# EAGLE design control AC (EAGLE 8.2.1)
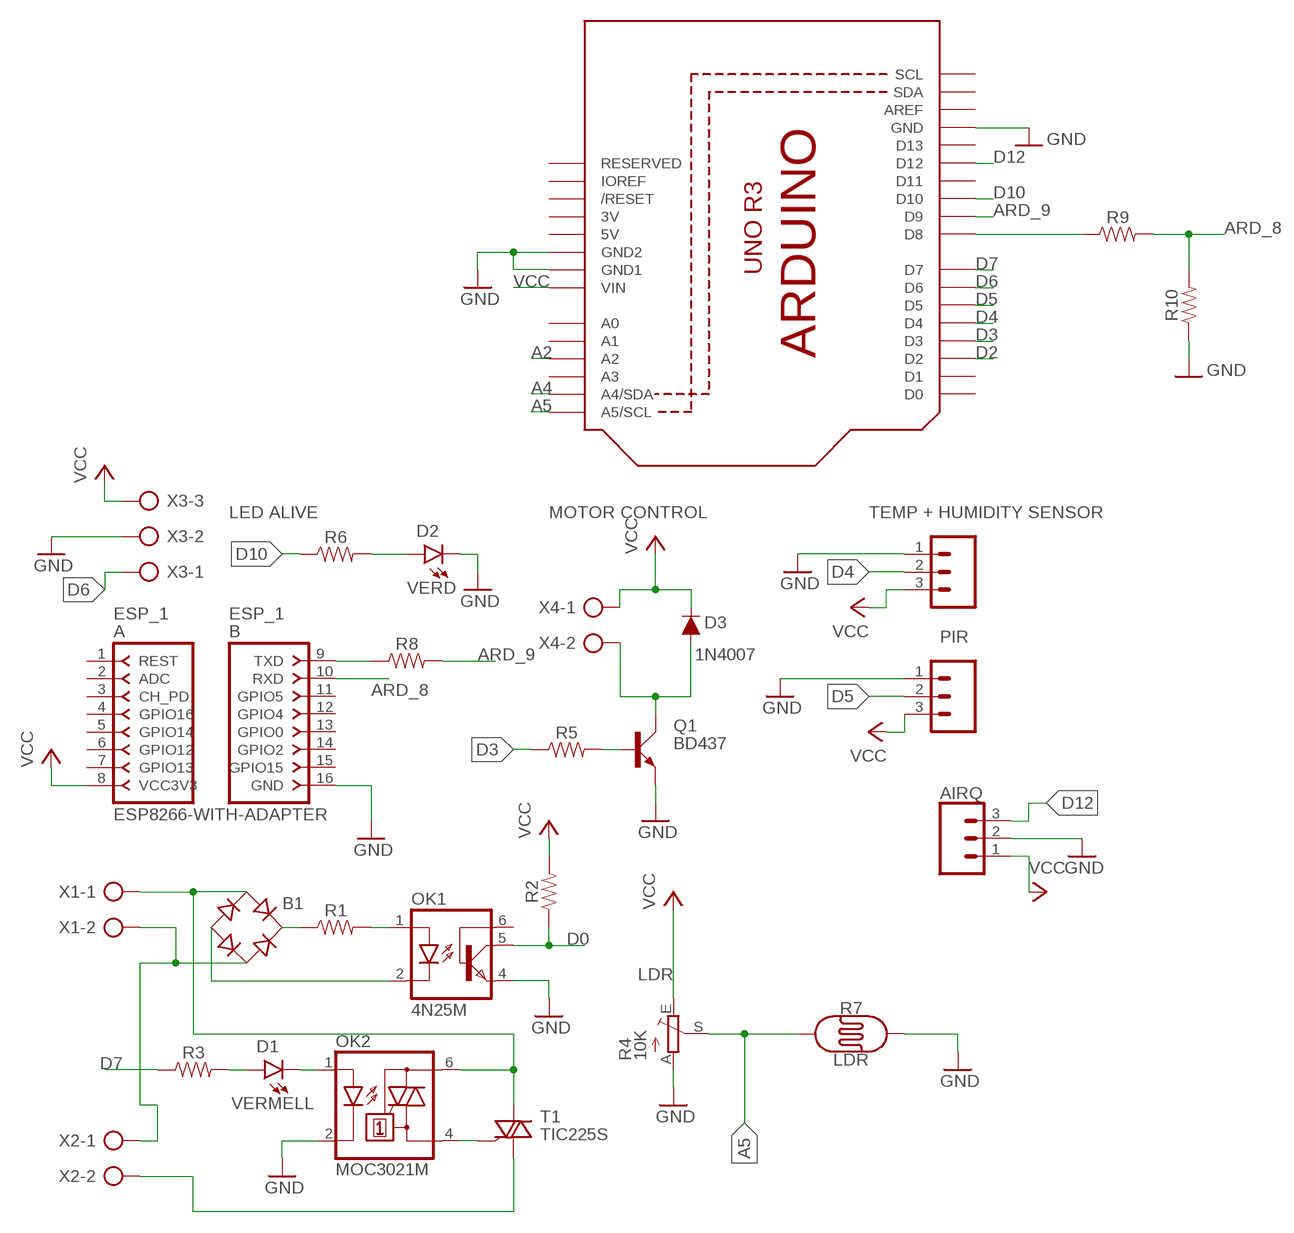
[diagram p0: schematic, sheet 1]

## Parts
AIRQ  CONN_03  [1X03]
B1  RB1A  [RB1A]
D1  VERMELL  LED-RED1206  [LED-1206]
D2  VERD  LED-FKIT-1206  [FKIT-LED-1206]
D3  1N4007  DIODE-PTH  [DIODE-1N4001]
ESP_1  ESP8266-WITH-ADAPTER  [ESP8266-ADAPTER]
OK1  4N25M  [DIL06]
OK2  MOC3021M  [DIL06]
PIR  455-1750-1-ND  CONN_03  [1X03]
Q1  BD437  [TO126AV]
R1  RESISTOR0805  [0805]
R2  RESISTOR0805  [0805]
R3  RESISTOR0805  [0805]
R4  10K  TRIM_EU-LI10  [LI10]
R5  RESISTOR0805  [0805]
R6  RESISTOR0805  [0805]
R7  LDR  PHOTOCELLPTH-KIT  [PHOTOCELL-KIT]
R8  RESISTOR0805  [0805]
R9  RESISTOR0805  [0805]
R10  RESISTOR0805  [0805]
T1  TIC225S  [TO220DS]
TEMP+HUM  455-1750-1-ND  CONN_03  [1X03]
U2  ARDUINOR3-DIMENSION  [ARDUINOR3]
X1  AK500/2  [AK500/2]
X2  AK500/2  [AK500/2]
X3  AK500/3  [AK500/3]
X4  AK500/2  [AK500/2]

## Nets
A2: U2.A2
A4: U2.A4(A4/SDA)
A5: R4.S R7.1 U2.A5(A5/SCL)
ARD_8: ESP_1.10(RXD) R9.2 R10.2
ARD_9: R8.2 U2.D9
D0: OK1.5(COL) R2.1
D2: U2.D2
D3: R5.1 U2.D3
D4: TEMP+HUM.2 U2.D4
D5: PIR.2 U2.D5
D6: U2.D6 X3.1
D7: R3.1 U2.D7
D10: R6.1 U2.D10
D12: AIRQ.3 U2.D12
GND: AIRQ.2 D2.C ESP_1.16(GND) OK1.4(EMI) OK2.2(C) PIR.1 Q1.E R4.A R7.2 R10.1 TEMP+HUM.1 U2.GND U2.GND1 U2.GND2 X3.2
N$1: OK1.1(A) R1.2
N$2: B1.+ R1.1
N$3: B1.- OK1.2(C)
N$4: B1.AC1 OK2.6(A2) T1.A2 X1.1
N$5: B1.AC2 X1.2 X2.1
N$6: Q1.B R5.2
N$7: D1.A R3.2
N$8: D1.C OK2.1(A)
N$9: D2.A R6.2
N$10: OK2.4(A1) T1.G
N$11: T1.A1 X2.2
N$12: D3.A Q1.C X4.2
N$13: ESP_1.9(TXD) R8.1
N$14: R9.1 U2.D8
VCC: AIRQ.1 D3.C ESP_1.8(VCC3V3) PIR.3 R2.2 R4.E TEMP+HUM.3 U2.VIN X3.3 X4.1
Unconnected: ESP_1.1(REST) ESP_1.2(ADC) ESP_1.3(CH_PD) ESP_1.4(GPIO16) ESP_1.5(GPIO14) ESP_1.6(GPIO12) ESP_1.7(GPIO13) ESP_1.11(GPIO5) ESP_1.12(GPIO4) ESP_1.13(GPIO0) ESP_1.14(GPIO2) ESP_1.15(GPIO15) OK1.6(BAS) U2.A0 U2.A1 U2.A3 U2.AREF U2.D0 U2.D1 U2.D11 U2.D13 U2.IOREF U2.RESERVED U2.RESET(/RESET) U2.SCL U2.SDA

## Notes on the sheet
- LED ALIVE | MOTOR CONTROL | TEMP + HUMIDITY SENSOR
- PIR
- LDR

## Power pins joined to a net without a drawn wire
3V: U2.3V
5V: U2.5V

## Library data of the parts
AIRQ = SparkFun-Connectors:CONN_03: Multi connection point. Often used as Generic Header-pin footprint for 0.1 inch spaced/style header connections On any of the 0.1 inch spaced packages, you can populate with these: Break Away Headers - Straight <https://www.sparkfun.com/products/116> (PRT-00116) Break Away Male Headers - Right Angle <https://www.sparkfun.com/products/553> (PRT-00553) Female Headers <https://www.sparkfun.com/products/115> (PRT-00115) Break Away Headers - Machine Pin <https://www.sparkfun.com/products/117> (PRT-00117) Break Away Female Headers - Swiss Machine Pin <https://www.sparkfun.com/products/743> (PRT-00743) Stackable Header - 3 Pin (Female, 0.1") <https://www.sparkfun.com/products/13875> (PRT-13875) For SCREWTERMINALS and SPRING TERMINALS visit here: Screw Terimnals on SparkFun.com <https://www.sparkfun.com/search/results?term=Screw+Terminals> (5mm/3.5mm/2.54mm spacing) This device is also useful as a general connection point to wire up your design to another part of your project. Our various solder wires solder well into these plated through hole pads. Hook-Up Wire - Assortment (Stranded, 22 AWG) <https://www.sparkfun.com/products/11375> (PRT-11375) Hook-Up Wire - Assortment (Solid Core, 22 AWG) <https://www.sparkfun.com/products/11367> (PRT-11367) View the entire wire category on our website here <https://www.sparkfun.com/categories/141> Special notes: Molex polarized connector foot print use with SKU : PRT-08232 with associated crimp pins and housings.
B1 = rectifier:RB1A: RECTIFIER 1 A
D1 = SparkFun-LED:LED-RED: Red SMD LED Used in manufacturing of most products at SparkFun Packages: 0603 - SMD 0603 package [Product Link] <http://docs.avagotech.com/docs/AV02-0551EN> 0603 SMART - SMD 0603 SMART package ( more efficient and expensive)[Product Link] <http://www.osram-os.com/Graphics/XPic2/00077099_0.pdf> 1206 - SMD1206 package [Product Link] <https://www.sparkfun.com/datasheets/DevTools/LilyPad/Q150OVS4.pdff> SparkFun Products: Pro Mini 328 -5V <https://www.sparkfun.com/products/821> RedBoard <https://www.sparkfun.com/products/12757> IOIO-OTG <https://www.sparkfun.com/products/13613>; PROD_ID: DIO-09912; VALUE: RED
D2 = SparkFun-LED:LED: LED (Generic) Standard schematic elements and footprints for 5mm, 3mm, 1206, and 0603 sized LEDs. Generic LEDs with no color specified.
D3 = SparkFun-DiscreteSemi:DIODE: Diode These are standard reverse protection diodes and small signal diodes. SparkFun Products: SparkFun SparkPunk Sound Kit <https://www.sparkfun.com/products/11177> SparkFun ESP8266 Thing <https://www.sparkfun.com/products/13231>; PROD_ID: DIO-09176; VALUE: 1A/50V/1.1V
ESP_1 = esp8266_with_adapter:ESP8266-WITH-ADAPTER: ESP8266 Adapter for ESP8266-03, ESP8266-04, ESP8266-07, ESP8266-08, ESP8266-12 and similar. (c) by Bartosz Batorek obi--wan@wp.pl
OK1 = optocoupler:4N*?M: General Purpose 6-Pin Phototransistor Optocouplers Source: http://www.fairchildsemi.com/ds/4N/4N35-M.pdf; MPN: 4N25-M; OC_FARNELL: 1021349; OC_NEWARK: 98K9084
OK2 = optocoupler:MOC30*M: RANDOM-PHASE OPTOISOLATORS TRIAC DRIVER OUTPUT Source: http://www.fairchildsemi.com MOC3020-M.pdf; MF: FAIRCHILD SEMICONDUCTOR; MPN: MOC3021-M; OC_FARNELL: 1021365; OC_NEWARK: 95B7895
PIR TEMP+HUM = SparkFun-Connectors:CONN_03: Multi connection point. Often used as Generic Header-pin footprint for 0.1 inch spaced/style header connections On any of the 0.1 inch spaced packages, you can populate with these: Break Away Headers - Straight <https://www.sparkfun.com/products/116> (PRT-00116) Break Away Male Headers - Right Angle <https://www.sparkfun.com/products/553> (PRT-00553) Female Headers <https://www.sparkfun.com/products/115> (PRT-00115) Break Away Headers - Machine Pin <https://www.sparkfun.com/products/117> (PRT-00117) Break Away Female Headers - Swiss Machine Pin <https://www.sparkfun.com/products/743> (PRT-00743) Stackable Header - 3 Pin (Female, 0.1") <https://www.sparkfun.com/products/13875> (PRT-13875) For SCREWTERMINALS and SPRING TERMINALS visit here: Screw Terimnals on SparkFun.com <https://www.sparkfun.com/search/results?term=Screw+Terminals> (5mm/3.5mm/2.54mm spacing) This device is also useful as a general connection point to wire up your design to another part of your project. Our various solder wires solder well into these plated through hole pads. Hook-Up Wire - Assortment (Stranded, 22 AWG) <https://www.sparkfun.com/products/11375> (PRT-11375) Hook-Up Wire - Assortment (Solid Core, 22 AWG) <https://www.sparkfun.com/products/11367> (PRT-11367) View the entire wire category on our website here <https://www.sparkfun.com/categories/141> Special notes: Molex polarized connector foot print use with SKU : PRT-08232 with associated crimp pins and housings.; PROD_ID: XXX-00000
Q1 = transistor-power:BD437: NPN TRANSISTOR
R1-R3 R5 R6 R8-R10 = SparkFun-Resistors:RESISTOR: Generic Resistor Package
R4 = pot:TRIM_EU-: POTENTIOMETER
R7 = SparkFun-Sensors:PHOTOCELL: Photocell (Photodetector, Photo Resistor, CdS) This is a very small light sensor. A photocell changes (also called a photodetector, photo resistor, CdS or photoconductive cell) resistance depending on the amount of light it is exposed to. These little sensors make great ambient light triggers (when light in the room turns on, do something). Datasheet <http://cdn.sparkfun.com/datasheets/Sensors/LightImaging/SEN-09088.pdf> SparkFun Products Mini Photocell <https://www.sparkfun.com/products/9088> (SEN-09088); PROD_ID: COMP-09129; SF_ID: SEN-09088
T1 = triac:TIC225S: TRIAC
U2 = adafruit_meva:ARDUINOR3: This is a new object for the new Arduino R3 - with extra pins that you may want to use (such as IOref, and duplicated A4/A5
X1 X2 X4 = con-ptr500:AK500/2: CONNECTOR; OC_FARNELL: unknown; OC_NEWARK: unknown
X3 = con-ptr500:AK500/3: CONNECTOR; OC_FARNELL: unknown; OC_NEWARK: unknown

## Board
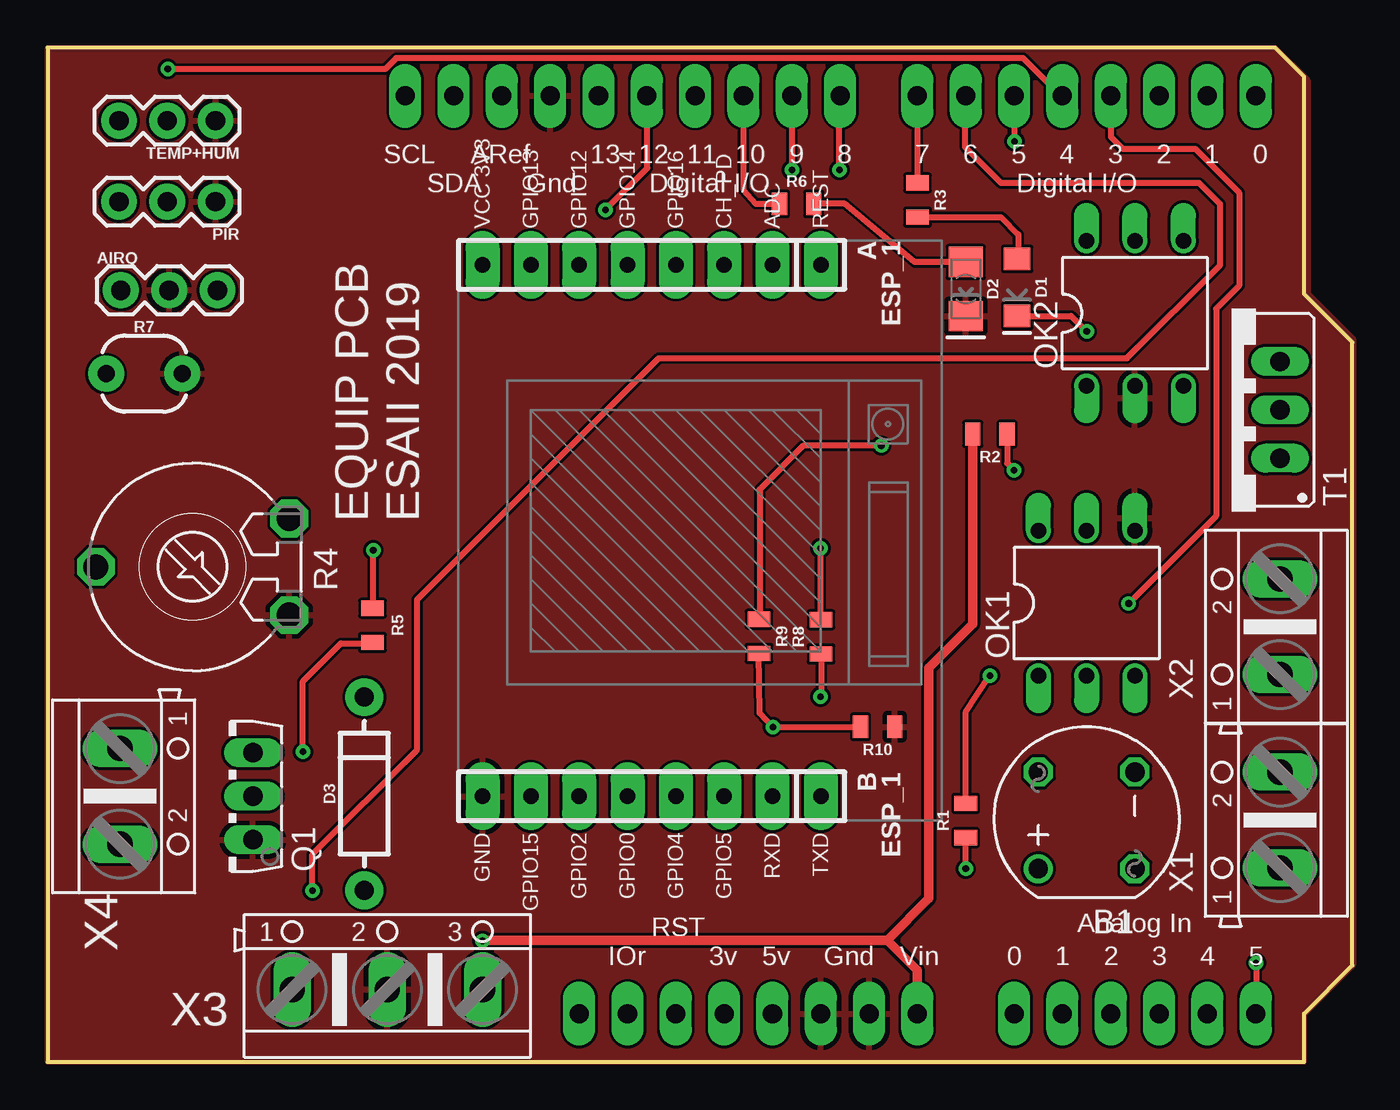
[diagram p1: board, top side]
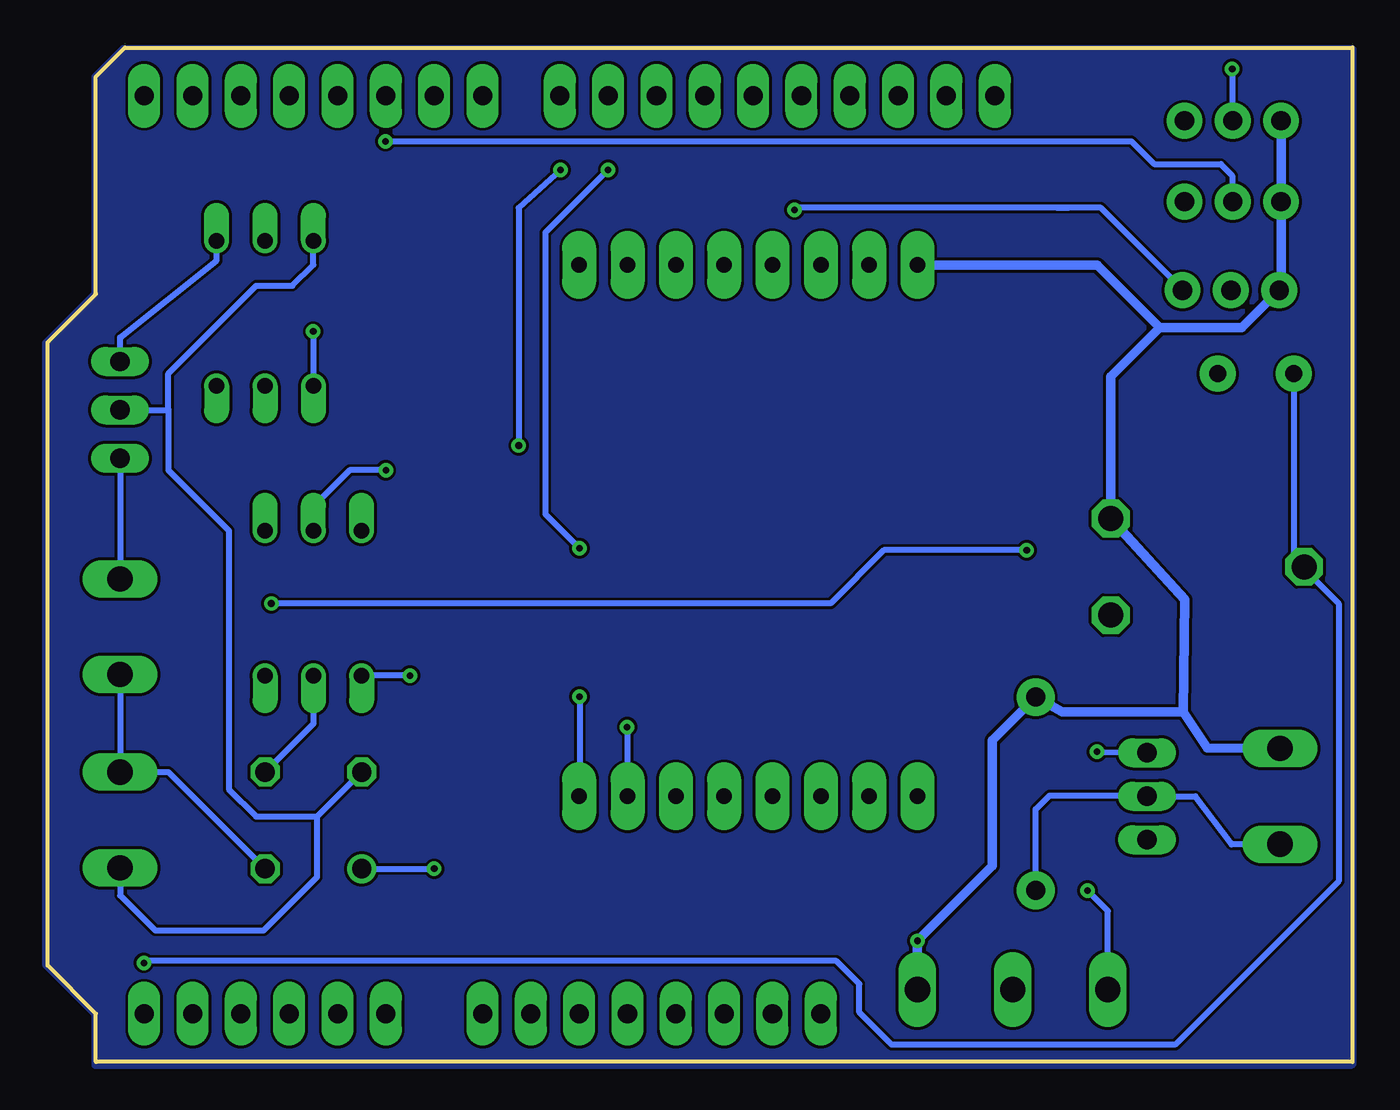
[diagram p2: board, bottom side, seen from below]

Size 68.58 x 53.34 mm. Coordinates in mm from the lower left corner, seen from the top.
Copper layers (1*16): Top 0.035mm / dielectric 1.5mm / Bottom 0.035mm
Design rules "default *": minimum track width 6mil, minimum drill 0.35mm, track to track 6mil, track to pad 6mil, pad to pad 6mil, via to via 6mil, smd to smd 6mil, copper to edge 0mil, drill to drill 0mil, minimum pad ring 10mil, minimum via ring 8mil, stop-mask expansion 4mil, vias tented up to drill 0mil, thermal gap 10mil

### Footprints (pad centres in the part's own frame; a part is rotated, then mirrored left to right if it is on the bottom)
1X03 = drill 1.016 pad 1.88: 1 0,0; 2 2.54,0; 3 5.08,0
RB1A = drill 1.016: + -2.54,2.54 | drill 1.016 octagon: - 2.54,-2.54; AC1 2.54,2.54; AC2 -2.54,-2.54
LED-1206 = smd 1.2 x 1.4: A -1.5,0; C 1.5,0
FKIT-LED-1206 = smd 1.6 x 1.803: A -1.422,0; C 1.422,0
DIODE-1N4001 = drill 1 pad 1.981: A -5.08,0; C 5.08,0
ESP8266-ADAPTER = drill 0.813 pad 1.778 long: 1 -13.97,8.89; 2 -13.97,6.35; 3 -13.97,3.81; 4 -13.97,1.27; 5 -13.97,-1.27; 6 -13.97,-3.81; 7 -13.97,-6.35; 8 -13.97,-8.89; 9 13.97,8.89; 10 13.97,6.35; 11 13.97,3.81; 12 13.97,1.27; 13 13.97,-1.27; 14 13.97,-3.81; 15 13.97,-6.35; 16 13.97,-8.89
DIL06 = drill 0.813 offset: 1 -2.54,-3.81; 2 0,-3.81; 3 2.54,-3.81; 4 2.54,3.81; 5 0,3.81; 6 -2.54,3.81
TO126AV = drill 1.016 long: B 2.286,-1.27; C 0,-1.27; E -2.286,-1.27
0805 = smd 0.8 x 1.2: 1 -0.9,0; 2 0.9,0
LI10 = drill 1.321 octagon: A -2.54,-5.08; E 2.54,-5.08; S 0,5.08
PHOTOCELL-KIT = drill 0.9 pad 1.88: 1 -2,0; 2 2,0
TO220DS = drill 1.016 long: A1 -2.54,-2.54; A2 0,-2.54; G 2.54,-2.54
ARDUINOR3 = drill 1 pad 1.676 long: 3V 35.56,2.54; 5V 38.1,2.54; A0 50.8,2.54; A1 53.34,2.54; A2 55.88,2.54; A3 58.42,2.54; A4 60.96,2.54; A5 63.5,2.54; AREF 23.876,50.8; D0 63.5,50.8; D1 60.96,50.8; D2 58.42,50.8; D3 55.88,50.8; D4 53.34,50.8; D5 50.8,50.8; D6 48.26,50.8; D7 45.72,50.8; D8 41.656,50.8; D9 39.116,50.8; D10 36.576,50.8; D11 34.036,50.8; D12 31.496,50.8; D13 28.956,50.8; GND 26.416,50.8; GND1 43.18,2.54; GND2 40.64,2.54; IOREF 30.48,2.54; RESERVED 27.94,2.54; RESET 33.02,2.54; SCL 18.796,50.8; SDA 21.336,50.8; VIN 45.72,2.54
AK500/2 = drill 1.321 long: 1 -2.515,0; 2 2.515,0
AK500/3 = drill 1.321 long: 1 -5.004,0; 2 0,0; 3 5.004,0

### Placement (x,y rotation side)
AIRQ  3.85,40.58 0 top
B1  54.61,12.7 90 top
D1  50.96,40.73 270 top
D2  48.26,40.64 270 top
D3  16.64,14.11 90 top
ESP_1  31.75,27.94 270 top
OK1  54.61,24.13 0 top
OK2  57.15,39.37 0 top
PIR  8.83,45.23 180 top
Q1  9.52,13.97 90 top
R1  48.26,12.7 90 top
R2  49.53,33.02 180 top
R3  45.72,45.32 270 top
R4  7.62,26.03 90 top
R5  17.07,22.96 270 top
R6  39.37,45.12 0 top
R7  5.08,36.2 0 top
R8  40.65,22.36 90 top
R9  37.39,22.38 270 top
R10  43.62,17.63 180 top
T1  62.23,34.29 90 top
TEMP+HUM  8.83,49.49 180 top
U2  0,0 0 top
X1  64.77,12.73 90 top
X2  64.77,22.89 90 top
X3  17.86,3.81 0 top
X4  3.81,13.97 270 top

### Tracks (layer width: path | path; a pad name or v marks a point on that pad's centre or on a via)
A5  (via drill 0.35)
  Top 0.305: v63.52,5.21 63.52,2.56 U2.A5
  Bottom 0.305: R7.1 3.08,26.58 R4.S 2.54,25.93 0.72,24.11 0.72,9.51 9.32,0.91 24.22,0.91 25.92,2.61 25.92,4.11 27.12,5.31 63.42,5.31 v63.52,5.21
ARD_8  (via drill 0.35)
  Top 0.305: R9.2 37.42,18.35 v38.12,17.61 42.54,17.61 R10.2
  Bottom 0.305: ESP_1.10 38.1,17.03 v38.12,17.61
ARD_9  (via drill 0.35)
  Top 0.305: U2.D9 39.12,47.61 v39.12,46.91 | v40.62,27.01 40.62,23.29 R8.2
  Bottom 0.305: v39.12,46.91 42.42,43.61 42.42,28.81 v40.62,27.01
D0  (via drill 0.35)
  Top 0.305: R2.1 50.43,31.48 v50.8,31.12
  Bottom 0.305: v50.8,31.12 52.7,31.12 54.61,29.21 OK1.5
D3  (via drill 0.35)
  Top 0.305: U2.D3 55.88,48.65 56.52,48.01 60.32,48.01 62.62,45.71 62.62,40.81 61.42,39.61 61.42,28.71 v56.82,24.11 | v17.12,26.91 17.12,23.91 R5.1
  Bottom 0.305: v17.12,26.91 24.62,26.91 27.42,24.11 v56.82,24.11
D4  (via drill 0.35)
  Top 0.305: U2.D4 53.25,50.8 51.27,52.78 18.32,52.78 17.75,52.21 v6.32,52.21
  Bottom 0.305: v6.32,52.21 6.32,49.5 TEMP+HUM.2
D5  (via drill 0.35)
  Top 0.305: U2.D5 50.8,48.43 v50.82,48.41
  Bottom 0.305: v50.82,48.41 11.62,48.41 10.42,47.21 6.92,47.21 6.32,46.61 6.32,45.27 PIR.2
D6  (via drill 0.35)
  Top 0.305: v13.92,9.01 13.92,10.91 19.42,16.41 19.42,24.31 32.12,37.01 56.72,37.01 61.62,41.91 61.62,45.11 60.52,46.21 50.12,46.21 48.22,48.11 48.22,50.76 U2.D6
  Bottom 0.305: X3.1 12.85,7.94 v13.92,9.01
D7
  Top 0.305: U2.D7 R3.1
D10
  Top 0.305: U2.D10 36.58,45.87 37.23,45.12 R6.1
D12  (via drill 0.35)
  Top 0.305: v29.32,44.81 31.52,47.01 31.52,50.78 U2.D12
  Bottom 0.305: 15.52,44.91 14.92,44.91 | 15.52,44.91 29.22,44.91 v29.32,44.81 | AIRQ.3 8.93,40.62 13.22,44.91 15.52,44.91
GND
  pour Top: 0.02,53.31 64.52,53.31 66.22,51.61 66.22,40.41 68.62,38.01 68.62,5.11 66.02,2.51 66.02,0.01 0.02,0.01
N$1  (via drill 0.35)
  Top 0.305: R1.2 48.26,18.41 v49.53,20.32
  Bottom 0.305: v49.53,20.32 OK1.1
N$2  (via drill 0.35)
  Top 0.305: v48.26,10.16 R1.1
  Bottom 0.305: B1.+ v48.26,10.16
N$3
  Bottom 0.305: OK1.2 54.61,17.78 B1.-
N$4
  Bottom 0.305: OK2.6 54.61,41.91 55.71,40.81 57.62,40.81 62.23,36.2 62.23,34.31 | 62.23,34.31 62.23,31.12 59.05,27.94 59.05,14.34 57.62,12.91 54.44,12.91 54.42,12.89 | T1.A2 62.25,34.29 62.23,34.31 | X1.1 64.77,8.76 62.92,6.91 57.22,6.91 54.42,9.71 54.42,12.89 | 54.42,12.89 B1.AC1
N$5
  Bottom 0.305: B1.AC2 62.23,15.24 X1.2 X2.1
N$6  (via drill 0.35)
  Top 0.305: v13.42,16.31 13.42,20.01 15.42,22.01 17.02,22.01 R5.2
  Bottom 0.305: v13.42,16.31 Q1.B
N$7
  Top 0.305: R3.2 50.11,44.42 51.02,43.51 51.02,42.29 D1.A
N$8  (via drill 0.35)
  Top 0.305: D1.C 53.8,39.23 v54.62,38.41
  Bottom 0.305: v54.62,38.41 OK2.1
N$9
  Top 0.305: R6.2 41.91,45.12 45.57,42.06 D2.A
N$10
  Bottom 0.305: T1.G 64.77,38.1 59.69,42.14 OK2.4
N$11
  Bottom 0.305: T1.A1 X2.2
N$12
  Bottom 0.305: X4.2 6.35,11.43 8.25,13.97 Q1.C 10.83,14.01 15.92,14.01 16.64,13.29 D3.A
N$13  (via drill 0.35)
  Top 0.305: R8.1 40.65,19.24 v40.62,19.21
  Bottom 0.305: v40.62,19.21 40.62,13.99 ESP_1.9
N$14  (via drill 0.35)
  Top 0.305: v41.62,46.91 41.62,50.76 U2.D8 | v43.82,32.41 39.72,32.41 37.42,30.11 37.42,23.31 R9.1
  Bottom 0.305: v41.62,46.91 43.82,44.91 v43.82,32.41
N$15
  pour Bottom: 0.02,53.31 64.62,53.31 66.12,51.81 66.12,40.41 68.72,37.81 68.72,5.11 66.12,2.51 66.12,-0.19 0.02,-0.19 -0.08,-0.09 -0.08,53.11 -0.08,53.21
VCC  (via drill 0.35)
  Top 0.305: 22.9,6.41 v22.86,6.37
  Top 0.508: U2.VIN 45.72,4.81 44.12,6.41 | 44.12,6.41 22.9,6.41 | R2.2 48.63,23.02 46.32,20.71 46.32,8.61 44.12,6.41
  Bottom 0.305: AIRQ.1 3.75,40.68
  Bottom 0.508: TEMP+HUM.3 PIR.3 3.75,40.68 | X4.1 7.62,16.51 8.89,18.41 | 8.89,18.41 15.24,18.41 D3.C 18.92,16.91 18.92,10.31 v22.86,6.37 X3.3 | ESP_1.8 13.42,41.91 10.12,38.61 | 10.12,38.61 5.82,38.61 AIRQ.1 | 10.12,38.61 12.7,36.03 R4.E 8.82,24.31 8.89,18.41

### Text on the board
tNames: EQUIP PCB / ESAII 2019